# EAGLE design msxpi (EAGLE 7.7.0)
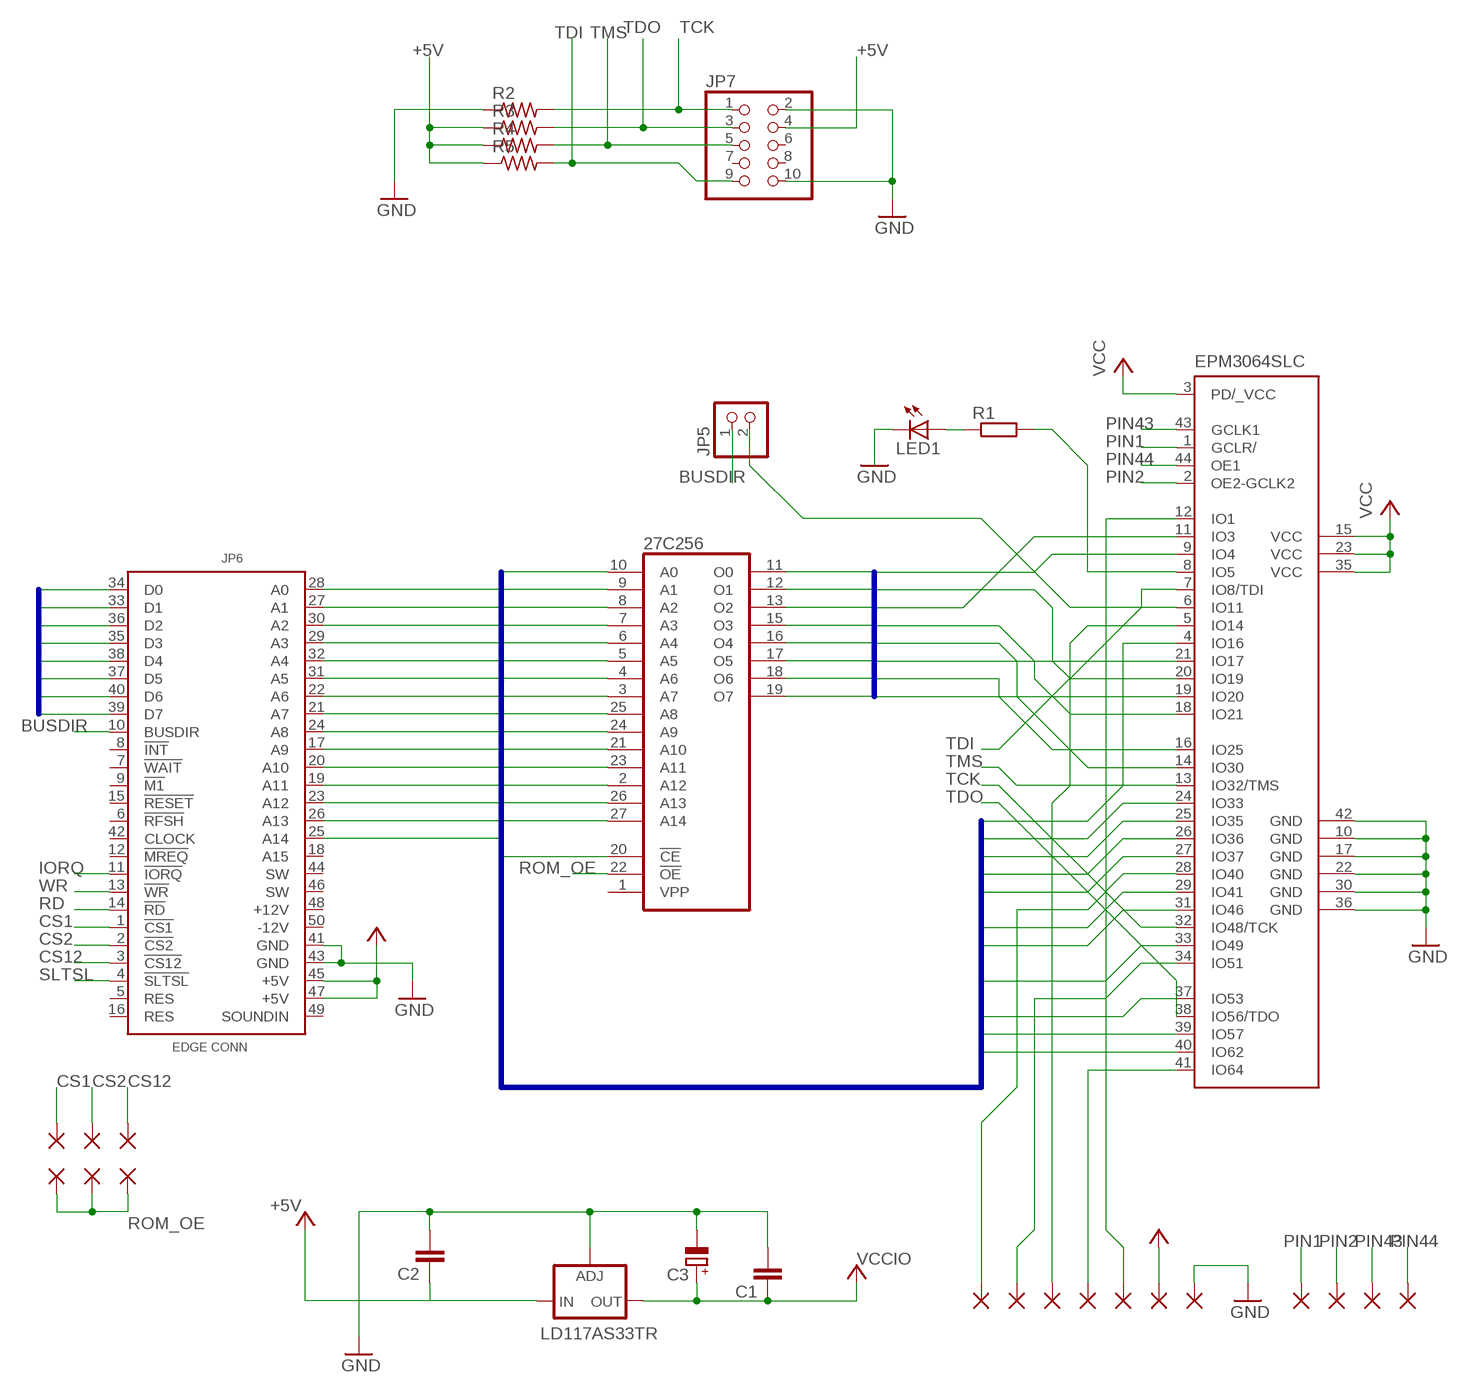
[diagram p0: schematic, sheet 1]

## Parts
27C256  27256  [DIL28]
+5V  2,15/1,0  [2,15/1,0]
C1  C2,5-3  [C2.5-3]
C2  C2,5-3  [C2.5-3]
C3  CPOL-EUE2.5-5  [E2,5-5]
CS1  2,15/1,0  [2,15/1,0]
CS2  2,15/1,0  [2,15/1,0]
CS12  2,15/1,0  [2,15/1,0]
EPM3064SLC  EPM3064S44  [PLCC-S44]
GND  2,15/1,0  [2,15/1,0]
GND4  2,15/1,0  [2,15/1,0]
GND9  2,15/1,0  [2,15/1,0]
GND10  2,15/1,0  [2,15/1,0]
GND11  2,15/1,0  [2,15/1,0]
IC1  LD117AS33TR  [SOT223]
JP5  PINHD-1X2  [1X02]
JP6  MSXCART1  [MSXCART]
JP7  PINHD-2X5/90  [2X05/90]
LED1  LED3MM  [LED3MM]
PAD1  2,15/1,0  [2,15/1,0]
PAD2  2,15/1,0  [2,15/1,0]
PAD8  2,15/1,0  [2,15/1,0]
PAD9  2,15/1,0  [2,15/1,0]
R1  R-EU_0207/7  [0207/7]
R2  R-US_0207/7  [0207/7]
R3  R-US_0207/7  [0207/7]
R4  R-US_0207/7  [0207/7]
R5  R-US_0207/7  [0207/7]
ROMOE1  2,15/1,0  [2,15/1,0]
ROMOE2  2,15/1,0  [2,15/1,0]
ROMOE3  2,15/1,0  [2,15/1,0]
SPI_CS_GPIO21  2,15/1,0  [2,15/1,0]

## Nets
+5V: +5V.1(P) C2.1 IC1.3(IN) JP6.45(+5V) JP6.47(+5V) JP7.4 R3.1 R4.1 R5.1 ; supply symbol labelled VCC
A0: 27C256.10(A0) EPM3064SLC.31(IO46) JP6.28(A0)
A1: 27C256.9(A1) EPM3064SLC.29(IO41) JP6.27(A1)
A2: 27C256.8(A2) EPM3064SLC.24(IO33) JP6.30(A2)
A3: 27C256.7(A3) EPM3064SLC.26(IO36) JP6.29(A3)
A4: 27C256.6(A4) EPM3064SLC.25(IO35) JP6.32(A4)
A5: 27C256.5(A5) EPM3064SLC.27(IO37) JP6.31(A5)
A6: 27C256.4(A6) EPM3064SLC.33(IO49) JP6.22(A6)
A7: 27C256.3(A7) EPM3064SLC.4(IO16) JP6.21(A7)
A8: 27C256.25(A8) JP6.24(A8)
A9: 27C256.24(A9) JP6.17(A9)
A10: 27C256.21(A10) JP6.20(A10)
A11: 27C256.23(A11) JP6.19(A11)
A12: 27C256.2(A12) JP6.23(A12)
A13: 27C256.26(A13) JP6.26(A13)
A14: 27C256.27(A14) JP6.25(A14)
BUSDIR: JP5.1 JP6.10(BUSDIR)
CS1: CS1.1(P) JP6.1(!CS1)
CS2: CS2.1(P) JP6.2(!CS2)
CS12: CS12.1(P) JP6.3(!CS12)
D0: 27C256.11(O0) EPM3064SLC.9(IO4) JP6.34(D0)
D1: 27C256.12(O1) EPM3064SLC.20(IO19) JP6.33(D1)
D2: 27C256.13(O2) EPM3064SLC.11(IO3) JP6.36(D2)
D3: 27C256.15(O3) EPM3064SLC.18(IO21) JP6.35(D3)
D4: 27C256.16(O4) EPM3064SLC.14(IO30) JP6.38(D4)
D5: 27C256.17(O5) EPM3064SLC.21(IO17) JP6.37(D5)
D6: 27C256.18(O6) EPM3064SLC.16(IO25) JP6.40(D6)
D7: 27C256.19(O7) EPM3064SLC.19(IO20) JP6.39(D7)
GND: C1.2 C2.2 C3.- EPM3064SLC.10(GND) EPM3064SLC.17(GND) EPM3064SLC.22(GND) EPM3064SLC.30(GND) EPM3064SLC.36(GND) EPM3064SLC.42(GND) GND.1(P) IC1.1(ADJ) JP6.41(GND) JP6.43(GND) JP7.2 JP7.10 LED1.K(C) R2.1
IORQ: EPM3064SLC.40(IO62) JP6.11(!IORQ)
MSXR1: EPM3064SLC.6(IO11) JP5.2
N$5: LED1.A R1.1
N$6: EPM3064SLC.8(IO5) R1.2
PI_RDY_GPIO25: EPM3064SLC.12(IO1) PAD2.1(P)
PIN1: EPM3064SLC.1(GCLR/) GND4.1(P)
PIN2: EPM3064SLC.2(OE2-GCLK2) GND9.1(P)
PIN43: EPM3064SLC.43(GCLK1) GND10.1(P)
PIN44: EPM3064SLC.44(OE1) GND11.1(P)
RD: EPM3064SLC.37(IO53) JP6.14(!RD)
ROM_OE: 27C256.22(!OE) ROMOE1.1(P) ROMOE2.1(P) ROMOE3.1(P)
SLTSL: 27C256.20(!CE) JP6.4(!SLTSL)
SPI_CS_GPIO21: EPM3064SLC.28(IO40) SPI_CS_GPIO21.1(P)
SPI_MISO_GPIO12: EPM3064SLC.41(IO64) PAD1.1(P)
SPI_MOSI_GPIO16: EPM3064SLC.5(IO14) PAD9.1(P)
SPI_SCLK_GPIO20: EPM3064SLC.34(IO51) PAD8.1(P)
TCK: EPM3064SLC.32(IO48/TCK) JP7.1 R2.2
TDI: EPM3064SLC.7(IO8/TDI) JP7.9 R5.2
TDO: EPM3064SLC.38(IO56/TDO) JP7.3 R3.2
TMS: EPM3064SLC.13(IO32/TMS) JP7.5 R4.2
VCCIO: C1.1 C3.+ EPM3064SLC.3(PD/_VCC) EPM3064SLC.15(VCC) EPM3064SLC.23(VCC) EPM3064SLC.35(VCC) IC1.4(OUT) ; supply symbol labelled VCC
WR: EPM3064SLC.39(IO57) JP6.13(!WR)
Unconnected: 27C256.1(VPP) JP6.5(RES) JP6.6(!RFSH) JP6.7(!WAIT) JP6.8(!INT) JP6.9(!M1) JP6.12(!MREQ) JP6.15(!RESET) JP6.16(RES) JP6.18(A15) JP6.42(CLOCK) JP6.44(SW) JP6.46(SW) JP6.48(+12V) JP6.49(SOUNDIN) JP6.50(-12V) JP7.6 JP7.7 JP7.8

## Buses
A[0..14],CS1,SLTSL,RD,WR,IORQ
D[0..7]

## Power pins joined to a net without a drawn wire
+5V: 27C256.28(VCC)
GND: 27C256.14(GND)

## Library data of the parts
27C256 = memory:27256: MEMORY
+5V CS1 CS2 CS12 GND GND4 GND9-GND11 PAD1 PAD2 PAD8 PAD9 ROMOE1-ROMOE3 SPI_CS_GPIO21 = wirepad:2,15/1,0: THROUGH-HOLE PAD
C1 C2 = capacitor-wima:C: CAPACITOR naming: grid - package width
C3 = rcl:CPOL-EU: POLARIZED CAPACITOR, European symbol
EPM3064SLC = EPM3064-PLCC:EPM3064: EPM3064 MAX 3000 family PLCC through hole socket; MPN: EPM3064SLC44-10N
IC1 = v-reg:LD117A?*: Low drop fixed and adjustable positive voltage regulators 1 A Source: http://www.st.com/stonline/products/literature/ds/7194/ld1117axx.pdf
JP5 = pinhead:PINHD-1X2: PIN HEADER
JP6 = msx-con-fbelavenuto:MSXCART
JP7 = pinhead:PINHD-2X5: PIN HEADER
LED1 = led:LED: LED OSRAM: - CHIPLED LG R971, LG N971, LY N971, LG Q971, LY Q971, LO R971, LY R971 LH N974, LH R974 LS Q976, LO Q976, LY Q976 LO Q996 - Hyper CHIPLED LW Q18S LB Q993, LB Q99A, LB R99A - SideLED LS A670, LO A670, LY A670, LG A670, LP A670 LB A673, LV A673, LT A673, LW A673 LH A674 LY A675 LS A676, LA A676, LO A676, LY A676, LW A676 LS A679, LY A679, LG A679 - Hyper Micro SIDELED® LS Y876, LA Y876, LO Y876, LY Y876 LT Y87S - SmartLED LW L88C, LW L88S LB L89C, LB L89S, LG L890 LS L89K, LO L89K, LY L89K LS L896, LA L896, LO L896, LY L896 - TOPLED LS T670, LO T670, LY T670, LG T670, LP T670 LSG T670, LSP T670, LSY T670, LOP T670, LYG T670 LG T671, LOG T671, LSG T671 LB T673, LV T673, LT T673, LW T673 LH T674 LS T676, LA T676, LO T676, LY T676, LB T676, LH T676, LSB T676, LW T676 LB T67C, LV T67C, LT T67C, LS T67K, LO T67K, LY T67K, LW E67C LS E67B, LA E67B, LO E67B, LY E67B, LB E67C, LV E67C, LT E67C LW T67C LS T679, LY T679, LG T679 LS T770, LO T770, LY T770, LG T770, LP T770 LB T773, LV T773, LT T773, LW T773 LH T774 LS E675, LA E675, LY E675, LS T675 LS T776, LA T776, LO T776, LY T776, LB T776 LHGB T686 LT T68C, LB T68C - Hyper Mini TOPLED® LB M676 - Mini TOPLED Santana® LG M470 LS M47K, LO M47K, LY M47K Source: http://www.osram.convergy.de LUXEON: - LUMILED® LXK2-PW12-R00, LXK2-PW12-S00, LXK2-PW14-U00, LXK2-PW14-V00 LXK2-PM12-R00, LXK2-PM12-S00, LXK2-PM14-U00 LXK2-PE12-Q00, LXK2-PE12-R00, LXK2-PE12-S00, LXK2-PE14-T00, LXK2-PE14-U00 LXK2-PB12-K00, LXK2-PB12-L00, LXK2-PB12-M00, LXK2-PB14-N00, LXK2-PB14-P00, LXK2-PB14-Q00 LXK2-PR12-L00, LXK2-PR12-M00, LXK2-PR14-Q00, LXK2-PR14-R00 LXK2-PD12-Q00, LXK2-PD12-R00, LXK2-PD12-S00 LXK2-PH12-R00, LXK2-PH12-S00 LXK2-PL12-P00, LXK2-PL12-Q00, LXK2-PL12-R00 Source: www.luxeon.com KINGBRIGHT: KA-3528ASYC Source: www.kingbright.com
R1 = rcl:R-EU_: RESISTOR, European symbol
R2-R5 = rcl:R-US_: RESISTOR, American symbol

## Board
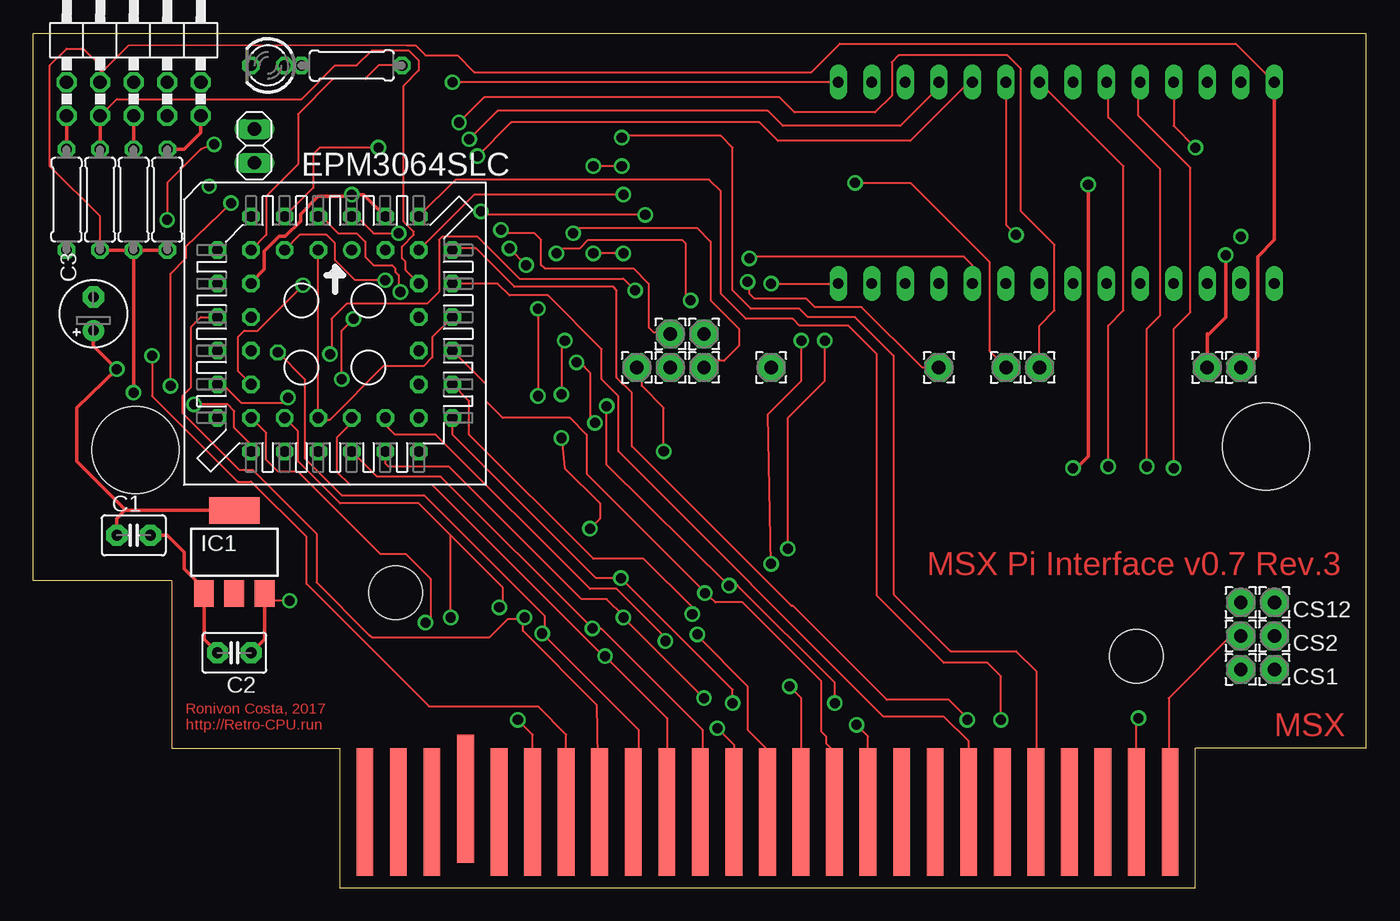
[diagram p1: board, top side]
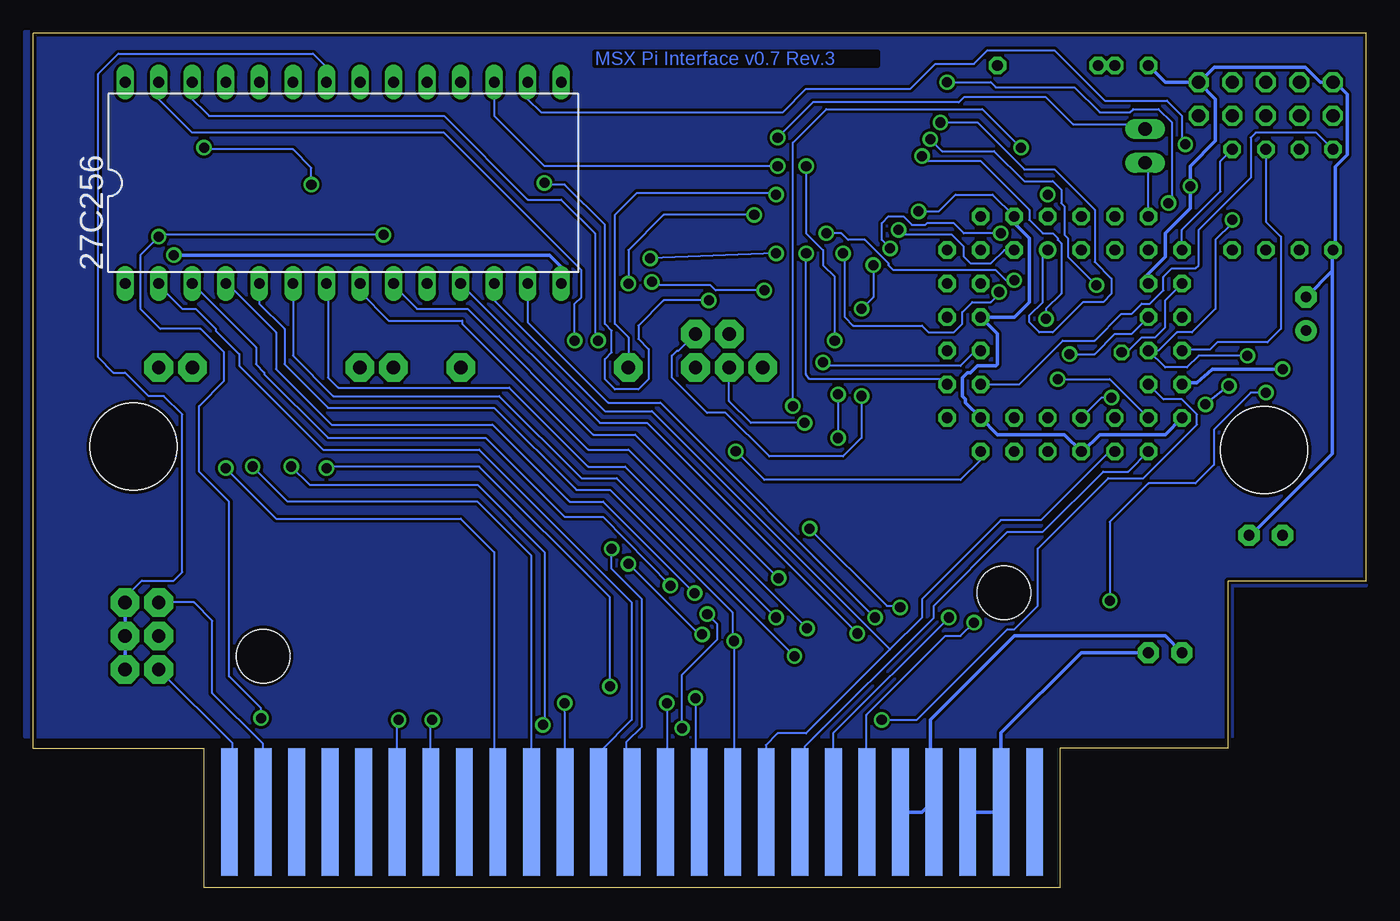
[diagram p2: board, bottom side, seen from below]

Size 100.96 x 64.68 mm. Coordinates in mm from the lower left corner, seen from the top.
Copper layers (1*16): Top 0.035mm / dielectric 1.5mm / Bottom 0.035mm
Design rules "default *": minimum track width 10mil, minimum drill 24mil, track to track 8mil, track to pad 8mil, pad to pad 8mil, via to via 8mil, smd to smd 8mil, copper to edge 10mil, drill to drill 8mil, minimum pad ring 10mil, minimum via ring 8mil, stop-mask expansion 4mil, vias tented up to drill 0mil, thermal gap 10mil

### Footprints (pad centres in the part's own frame; a part is rotated, then mirrored left to right if it is on the bottom)
DIL28 = drill 0.813 long: 1 -16.51,-7.62; 2 -13.97,-7.62; 3 -11.43,-7.62; 4 -8.89,-7.62; 5 -6.35,-7.62; 6 -3.81,-7.62; 7 -1.27,-7.62; 8 1.27,-7.62; 9 3.81,-7.62; 10 6.35,-7.62; 11 8.89,-7.62; 12 11.43,-7.62; 13 13.97,-7.62; 14 16.51,-7.62; 15 16.51,7.62; 16 13.97,7.62; 17 11.43,7.62; 18 8.89,7.62; 19 6.35,7.62; 20 3.81,7.62; 21 1.27,7.62; 22 -1.27,7.62; 23 -3.81,7.62; 24 -6.35,7.62; 25 -8.89,7.62; 26 -11.43,7.62; 27 -13.97,7.62; 28 -16.51,7.62
2,15/1,0 = drill 1.016 pad 2.159 octagon: 1 0,0
C2.5-3 = drill 0.813 pad 1.6 octagon: 1 -1.27,0; 2 1.27,0
E2,5-5 = drill 0.813 pad 1.6: + -1.27,0 | drill 0.813 pad 1.6 octagon: - 1.27,0
PLCC-S44 = drill 0.813: 1 1.27,6.35 | drill 0.813 octagon: 2 -1.27,8.89; 3 -1.27,6.35; 4 -3.81,8.89; 5 -3.81,6.35; 6 -6.35,8.89; 7 -8.89,6.35; 8 -6.35,6.35; 9 -8.89,3.81; 10 -6.35,3.81; 11 -8.89,1.27; 12 -6.35,1.27; 13 -8.89,-1.27; 14 -6.35,-1.27; 15 -8.89,-3.81; 16 -6.35,-3.81; 17 -8.89,-6.35; 18 -6.35,-8.89; 19 -6.35,-6.35; 20 -3.81,-8.89; 21 -3.81,-6.35; 22 -1.27,-8.89; 23 -1.27,-6.35; 24 1.27,-8.89; 25 1.27,-6.35; 26 3.81,-8.89; 27 3.81,-6.35; 28 6.35,-8.89; 29 8.89,-6.35; 30 6.35,-6.35; 31 8.89,-3.81; 32 6.35,-3.81; 33 8.89,-1.27; 34 6.35,-1.27; 35 8.89,1.27; 36 6.35,1.27; 37 8.89,3.81; 38 6.35,3.81; 39 8.89,6.35; 40 6.35,8.89; 41 6.35,6.35; 42 3.81,8.89; 43 3.81,6.35; 44 1.27,8.89
SOT223 = smd 1.5 x 2: 1 -2.3,-3.15; 2 0,-3.15; 3 2.3,-3.15 | smd 3.8 x 2: 4 0,3.15
1X02 = drill 1.016 long: 1 -1.27,0; 2 1.27,0
MSXCART = smd 1.27 x 9.652 bottom: 1 86.081,5.715; 3 83.541,5.715; 5 81.001,5.715; 7 78.461,5.715; 9 75.921,5.715; 11 73.381,5.715; 13 70.841,5.715; 15 68.301,5.715; 17 65.761,5.715; 19 63.221,5.715; 21 60.681,5.715; 23 58.141,5.715; 25 55.601,5.715; 27 53.061,5.715; 29 50.521,5.715; 31 47.981,5.715; 33 45.441,5.715; 35 42.901,5.715; 37 40.361,5.715; 39 37.821,5.715; 41 35.281,5.715; 43 32.741,5.715; 45 30.201,5.715; 47 27.661,5.715; 49 25.121,5.715 | smd 1.27 x 9.652: 2 86.081,5.715; 4 83.541,5.715; 6 81.001,5.715; 8 78.461,5.715; 10 75.921,5.715; 12 73.381,5.715; 14 70.841,5.715; 16 68.301,5.715; 18 65.761,5.715; 20 63.221,5.715; 22 60.681,5.715; 24 58.141,5.715; 26 55.601,5.715; 28 53.061,5.715; 30 50.521,5.715; 32 47.981,5.715; 34 45.441,5.715; 36 42.901,5.715; 38 40.361,5.715; 40 37.821,5.715; 42 35.281,5.715; 44 32.741,6.731; 46 30.201,5.715; 48 27.661,5.715; 50 25.121,5.715 | hole 4.064: 27.461,22.326; 83.53,17.526 | hole 6.604: 93.349,33.388; 7.742,33.118
2X05/90 = drill 1.016 octagon: 1 -5.08,-6.35; 2 -5.08,-3.81; 3 -2.54,-6.35; 4 -2.54,-3.81; 5 0,-6.35; 6 0,-3.81; 7 2.54,-6.35; 8 2.54,-3.81; 9 5.08,-6.35; 10 5.08,-3.81
LED3MM = drill 0.813 octagon: A -1.27,0; K 1.27,0
0207/7 = drill 0.813 octagon: 1 -3.81,0; 2 3.81,0

### Placement (x,y rotation side)
27C256  77.47,53.34 0 bottom
+5V  91.44,39.37 0 top
C1  7.62,26.67 0 top
C2  15.24,17.78 180 top
C3  4.57,43.43 90 top
CS1  91.44,16.51 0 top
CS2  91.44,19.05 0 top
CS12  91.44,21.59 0 top
EPM3064SLC  22.86,41.91 0 top
GND  88.9,39.37 0 top
GND4  76.2,39.37 0 top
GND9  73.66,39.37 0 top
GND10  48.26,41.91 0 top
GND11  50.8,41.91 0 top
IC1  15.24,25.4 0 top
JP5  16.76,56.13 270 top
JP6  0,0 0 top
JP7  7.62,64.77 0 top
LED1  17.78,62.23 180 top
PAD1  55.88,39.37 0 top
PAD2  68.58,39.37 0 top
PAD8  48.26,39.37 0 top
PAD9  50.8,39.37 0 top
R1  24.13,62.23 0 top
R2  2.54,52.07 90 top
R3  5.08,52.07 90 top
R4  7.62,52.07 90 top
R5  10.16,52.07 90 top
ROMOE1  93.98,21.59 0 top
ROMOE2  93.98,19.05 0 top
ROMOE3  93.98,16.51 0 top
SPI_CS_GPIO21  45.72,39.37 0 top

### Tracks (layer width: path | path; a pad name or v marks a point on that pad's centre or on a via)
+5V  (via drill 0.76 pad 0.76)
  Top 0.127: JP7.4 5.08,61.6 7.24,63.75 28.32,63.75
  Top 0.152: 27C256.28 92.58,62.36 91.95,62.99 91.06,63.88 61.09,63.88 58.93,61.72 33.4,61.72 32.13,62.99 29.72,62.99 28.96,63.75 28.32,63.75 | R3.1 5.08,50.8 1.27,54.61 1.27,62.23 2.54,63.5 3.81,63.5 5.08,62.23 JP7.4 | v19.43,21.72 18.07,21.72 IC1.3
  Top 0.254: 27C256.28 93.98,49.02 92.71,47.75 92.71,40.26 91.82,39.37 +5V.1 | R5.1 R4.1 | R4.1 R3.1 | IC1.3 17.54,18.81 C2.1 | v7.62,37.47 R4.1
  Bottom 0.152: v19.43,21.72 19.43,27.69 16.51,30.61 12.95,30.61 11.56,32 11.56,34.67 8.76,37.47 v7.62,37.47
  Bottom 0.254: C2.1 21.59,17.78 27.66,11.71 JP6.47 JP6.45
A0  (via drill 0.76 pad 0.76)
  Top 0.152: 27C256.10 71.12,47.12 70.48,47.75 54.36,47.75 v54.23,47.62 | v51.82,12.06 53.06,10.82 JP6.28 | EPM3064SLC.31 33.02,36.83 33.02,34.29 42.42,24.89 46.23,24.89 49.91,21.21 v49.91,20.7 | v44.7,48.01 v42.42,48.01
  Bottom 0.152: EPM3064SLC.31 32.13,38.48 42.16,38.48 42.42,38.86 v42.42,48.01 | v51.82,12.06 51.82,16.13 49.15,18.8 49.15,19.94 v49.91,20.7 | v44.7,48.01 v54.23,47.62
A1  (via drill 0.76 pad 0.76)
  Top 0.152: v52.96,13.97 52.96,14.99 v44.51,23.43 42.61,23.43 31.75,34.29 EPM3064SLC.29
  Bottom 0.152: 27C256.9 73.66,45.59 71.88,43.82 68.07,43.82 58.55,34.29 55.37,34.29 v44.51,23.43 | v52.96,13.97 52.96,5.82 JP6.27
A2  (via drill 0.76 pad 0.76)
  Top 0.152: JP6.30 50.67,5.87 50.67,11.94 42.99,19.62 v42.35,19.62 30.86,31.11 26.04,31.11 EPM3064SLC.24
  Bottom 0.152: 27C256.8 76.2,45.09 74.04,42.93 68.45,42.93 68.45,42.67 58.93,33.15 55.88,33.15 v42.35,19.62
A3  (via drill 0.76 pad 0.76)
  Top 0.152: EPM3064SLC.26 26.67,32.13 26.92,31.88 31.5,31.88 41.53,21.84 43.43,21.84 44.7,20.57 v44.7,20.45 v50.8,14.35
  Bottom 0.152: 50.42,5.82 JP6.29 50.8,5.99 v50.8,14.35 | 27C256.7 78.61,45.72 78.61,38.61 77.85,37.85 64.9,37.85 58.93,31.88 56.13,31.88 v44.7,20.45
A4  (via drill 0.76 pad 0.76)
  Top 0.152: EPM3064SLC.25 24.13,35.18 22.99,34.04 22.99,31.5 24,30.48 30.23,30.48 43.18,17.53 v43.31,17.53 48.01,12.83 48.01,5.74 JP6.32
  Bottom 0.152: 27C256.6 81.28,40.26 78.23,37.21 65.66,37.21 59.44,30.99 56.77,30.99 v43.31,17.53
A5  (via drill 0.76 pad 0.76)
  Top 0.152: EPM3064SLC.27 26.67,35.05 27.43,34.29 30.48,34.29 42.16,22.61 44.2,22.61 47.88,18.92 v47.88,18.67
  Bottom 0.152: JP6.31 47.88,5.82 v47.88,18.67 48.01,18.8 48.01,20.83 57.28,30.1 59.82,30.1 66.04,36.32 78.61,36.32 81.91,39.62 81.91,42.29 83.82,44.2 27C256.5
A6  (via drill 0.76 pad 0.76)
  Top 0.152: 51.25,21.99 v50.86,22.29 | EPM3064SLC.33 34.29,38.1 34.29,36.83 35.56,35.56 40.64,35.56 41.91,34.29 41.91,31.33 51.25,21.99 | 51.25,21.99 51.65,21.59 53.72,21.59 59.69,15.62 59.69,11.81 60.05,11.45 60.05,10.95 60.58,10.41 60.58,5.82 JP6.22
  Bottom 0.152: 27C256.4 86.23,45.72 82.55,42.04 82.55,39.24 78.36,35.05 66.17,35.05 60.33,29.21 57.78,29.21 v50.86,22.29
A7  (via drill 0.76 pad 0.76)
  Top 0.152: v60.71,13.97 60.71,15.49 53.34,22.86 v52.7,22.86 43.43,32 v43.43,36.45 | v26.16,56.01 21.72,56.01 21.21,55.5 21.21,52.96 EPM3064SLC.4
  Bottom 0.152: v43.43,36.45 43.43,56.39 40.89,58.93 29.08,58.93 v26.16,56.01 | JP6.21 60.68,12.68 v60.71,13.97 | 27C256.3 88.9,45.47 88.65,45.47 84.07,40.89 84.07,39.62 83.44,38.99 83.44,38.86 78.61,34.04 66.67,34.04 60.71,28.07 57.78,28.07 v52.7,22.86
A8  (via drill 0.76 pad 0.76)
  Top 0.152: JP6.24 58.14,14.38 v57.28,15.24 | 27C256.25 86.36,57.66 v88.01,56.01
  Top 0.254: v78.74,31.75 78.99,31.75 79.88,32.64 v79.88,53.21
  Bottom 0.152: v57.28,15.24 57.28,21.97 67.18,31.88 78.61,31.88 v78.74,31.75 | v79.88,53.21 79.88,54.48 81.28,55.88 87.88,55.88 v88.01,56.01
A9  (via drill 0.76 pad 0.76)
  Top 0.152: v86.36,31.75 86.36,42.29 87.63,43.56 87.63,54.48 83.69,58.42 83.69,60.83 27C256.24
  Bottom 0.152: v86.36,31.75 82.55,27.94 68.58,27.94 66.04,25.4 66.04,5.99 JP6.17
A10  (via drill 0.76 pad 0.76)
  Top 0.152: JP6.20 63.22,11.45 v62.36,12.32 | v81.41,31.88 81.41,42.55 82.55,43.69 82.55,54.61 27C256.21
  Bottom 0.152: v81.41,31.88 80.01,30.48 67.31,30.48 62.23,25.4 62.23,12.45 v62.36,12.32
A11  (via drill 0.76 pad 0.76)
  Top 0.152: v84.33,31.88 84.33,42.29 85.34,43.31 85.34,54.36 81.41,58.29 81.41,60.83 27C256.23
  Bottom 0.152: JP6.19 63.22,25.12 67.31,29.21 81.66,29.21 v84.33,31.88
A12
  Bottom 0.152: 27C256.2 91.44,45.59 89.66,43.82 88.65,43.82 87.12,42.29 87.12,42.16 85.34,40.39 85.34,39.5 78.99,33.15 67.18,33.15 55.63,21.59 55.63,12.7 57.91,10.41 57.91,9.27 58.55,8.64
  Bottom 0.254: 58.55,8.64 58.55,6.12 JP6.23
A13  (via drill 0.76 pad 0.76)
  Top 0.152: v55.88,24.51 55.63,35.81 58.17,38.35 v58.17,41.4 | v50.29,19.18 50.29,19.05 54.1,15.24 54.1,11.94 55.6,10.44
  Top 0.254: JP6.26 55.6,10.44
  Bottom 0.152: 27C256.26 89.15,60.71 89.15,59.94 87.63,58.42 69.85,58.42 63.5,52.07 60.96,52.07 58.42,49.53 58.42,41.66 v58.17,41.4 | 50.55,19.18 v55.88,24.51
  Bottom 0.254: v50.29,19.18 50.55,19.18
A14  (via drill 0.76 pad 0.76)
  Top 0.152: v57.15,25.65 57.15,35.56 59.94,38.35 v59.94,41.4
  Bottom 0.152: JP6.25 55.6,6.73 55.6,9.88 | 56.01,10.29 56.01,11.05 54.86,12.19 54.86,21.84 57.15,24.13 v57.15,25.65 | v59.94,41.4 59.94,44.2 59.44,44.7 59.44,46.74 69.85,57.15 88.9,57.15 91.44,59.69 27C256.27
  Bottom 0.254: 56.01,10.29 56.01,7.14 55.6,6.73
BUSDIR  (via drill 0.76 pad 0.76)
  Top 0.152: JP6.10 75.95,5.74 75.95,16.38 74.42,17.91 69.47,17.91 65.15,22.22 65.15,40.26 62.23,43.18 58.67,43.18 58.04,43.82 54.36,43.82 52.96,45.21 52.96,56.01 52.07,56.9 44.7,56.9 v44.58,56.77
  Bottom 0.152: v44.58,56.77 41.91,59.44 30.86,59.44 30.48,59.82 24.26,59.82 22.23,57.79 17.14,57.79 JP5.1
CS1
  Bottom 0.152: JP6.1 85.85,5.94 85.85,10.92 CS1.1
CS2
  Top 0.152: CS2.1 90.68,19.05 85.98,14.35 85.98,5.82 JP6.2
CS12
  Bottom 0.152: JP6.3 83.54,10.9 87.38,14.73 87.38,20.19 88.77,21.59 CS12.1
D0  (via drill 0.76, 0.76 pad 0.76)
  Top 0.152: v18.54,40.51 20.57,38.48 20.57,32.51 23.37,29.72 29.59,29.72 38.73,20.57 38.73,19.43 v38.54,19.24 45.85,11.94 45.85,6.12 JP6.34
  Bottom 0.152: v18.54,40.51 18.16,40.51 17.02,41.66 16,41.66 15.24,42.42 15.24,44.45 EPM3064SLC.9 | 27C256.11 58.04,35.18 54.48,35.18 v38.54,19.24
D1
  Bottom 0.152: 36.07,18.03 42.42,11.68 44.58,11.68 45.47,10.79 45.47,6.48 45.59,6.35 45.59,5.87 JP6.33 | 27C256.12 66.04,44.45 57.66,36.07 54.1,36.07 36.07,18.03 | EPM3064SLC.20 19.43,33.02 24.64,27.81 27.69,27.81 33.66,21.84 33.66,20.45 36.07,18.03
D2  (via drill 0.76 pad 0.76)
  Top 0.152: JP6.36 42.8,5.82 42.67,13.84 37.08,19.43 37.08,20.32 | EPM3064SLC.11 12.7,43.18 11.94,42.42 11.94,37.85 11.3,37.21 11.3,35.94 15.62,31.62 16.64,31.62 21.46,26.8 21.46,23.11 25.46,19.11 25.65,18.92 34.54,18.92 35.94,20.32 37.08,20.32 | 37.08,20.32 v37.21,20.45
  Bottom 0.152: 27C256.13 63.5,42.8 57.4,36.7 53.47,36.7 v37.21,20.45
D3  (via drill 0.76 pad 0.76)
  Top 0.152: 27C256.15 v31.75,60.96 | v14.99,51.82 11.56,48.51 11.56,47.62 10.41,46.48 v10.41,37.97 | EPM3064SLC.18 16.51,33.53 15.24,34.8 15.24,36.07 14.73,36.58 v12.19,36.58
  Bottom 0.152: 16.51,32.77 EPM3064SLC.18 18.03,31.5 19.94,31.5 24.51,26.92 27.18,26.92 32.77,21.34 32.77,20.45 42.54,10.67 42.54,6.07 JP6.35 | v31.75,60.96 28.45,60.96 28.07,60.58 22.1,60.58 20.19,58.67 17.91,58.67 17.65,58.93 15.75,58.93 14.73,57.91 14.73,52.07 v14.99,51.82 | v10.41,37.97 v12.19,36.58
D4  (via drill 0.76 pad 0.76)
  Top 0.152: JP6.38 40.36,11.58 38.23,13.72 29.97,13.72 20.7,22.99 20.7,26.54 16.51,30.73 15.49,30.73 9.02,37.21 v9.02,40.26 | v13.72,56.26 12.7,55.88 10.16,53.34 v10.16,50.55
  Bottom 0.152: 27C256.16 63.5,59.69 62.48,58.67 44.2,58.67 42.42,60.45 34.54,60.45 32.64,62.36 29.72,62.36 28.7,63.37 23.62,63.37 19.81,59.56 15.11,59.56 13.97,58.42 13.97,56.52 v13.72,56.26 | v10.16,50.55 10.16,50.29 11.43,49.02 11.43,43.82 13.21,42.04 14.35,42.04 15.75,40.64 EPM3064SLC.14 15.24,39.37 13.59,39.37 12.7,40.26 v9.02,40.26
D5  (via drill 0.76 pad 0.76)
  Top 0.152: v31.62,20.45 31.62,26.67 | 31.62,26.67 29.21,29.08 23.24,29.08 20.07,32.26 20.07,34.54 EPM3064SLC.21 | v44.58,54.61 v42.42,54.61 | 31.62,26.67 35.56,22.73 35.56,21.46 v35.31,21.21 | v40,34.04 40.26,31.75 42.93,29.08 42.93,27.94 v42.16,27.18 | v40.26,41.4 40.26,41.28 40,41.02 v40,37.34
  Bottom 0.152: JP6.37 40.36,11.71 v31.62,20.45 | 27C256.17 66.04,58.42 62.23,54.61 v44.58,54.61 | v42.42,54.61 42.42,49.53 41.15,48.26 41.15,47.12 40.26,46.23 v40.26,41.4 | v42.16,27.18 36.32,21.34 35.43,21.34 v35.31,21.21 | v40,37.34 v40,34.04
D6  (via drill 0.76 pad 0.76)
  Top 0.152: 27C256.18 68.58,60.58 65.66,57.66 56.77,57.66 55.63,58.8 35.18,58.8 v33.02,56.64 | EPM3064SLC.16 15.49,39.12 15.49,41.66 16,42.16 17.02,42.16 v20.45,45.59 | JP6.40 37.82,11.58 v36.7,12.7
  Bottom 0.152: v36.7,12.7 34.04,12.7 27.18,19.56 26.67,19.56 24.89,21.34 24.89,25.65 19.56,30.99 16.89,30.99 12.83,35.05 12.83,35.81 13.97,36.96 15.37,36.96 EPM3064SLC.16 | v33.02,56.64 32.13,55.75 28.19,55.75 25.91,53.47 23.75,53.47 23.11,52.83 23.11,51.82 22.86,51.56 22.86,49.4 22.61,49.15 22.61,47.75 v20.45,45.59
D7  (via drill 0.76 pad 0.76)
  Top 0.152: 27C256.19 70.87,60.96 66.42,56.52 56.39,56.52 54.99,57.91 36.2,57.91 v33.66,55.37 | v23.37,38.48 23.37,42.16 v24.26,43.05 | EPM3064SLC.19 17.65,34.42 17.65,32.39 18.54,31.5 20.07,31.5 26.29,25.27 28.19,25.27 30.1,23.37 30.1,20.45 v29.72,20.07
  Bottom 0.152: JP6.39 37.85,5.74 37.85,13.08 31.88,19.05 30.73,19.05 v29.72,20.07 | 24.26,43.43 v24.26,43.05 24.26,43.82 23.11,44.96 23.11,48.77 23.37,49.02 23.37,49.15 23.75,49.53 24.51,49.53 25.53,50.55 25.53,51.31 29.21,54.99 33.27,54.99 v33.66,55.37 | v23.37,38.48 19.43,38.48 EPM3064SLC.19
GND  (via drill 0.76, 0.76 pad 0.76)
  Top 0.152: v46.35,50.93 34.16,50.93 v33.91,51.18 | v55.88,45.72 27C256.14
  Top 0.254: C2.2 12.94,18.81 IC1.1 12.94,22.62 11.43,24.13 11.43,25.4 10.16,26.67 C1.2 | 88.9,41.78 90.3,43.18 v90.3,47.88 | 26.64,50.67 EPM3064SLC.42 25.02,52.45 v24.13,52.45 24,52.32 21.59,52.32 20.24,50.98 20.24,50.44 19.1,49.3 18.64,49.3 17.5,48.16 17.5,46.79 16.59,45.87 EPM3064SLC.10 | 88.9,41.78 88.9,41.91 | 88.9,41.78 GND.1
  Bottom 0.152: v33.91,51.18 32.38,51.18 31.11,52.45 28.32,52.45 EPM3064SLC.42 | v46.35,50.93 53.21,50.93 55.88,48.26 v55.88,45.72
  Bottom 0.254: C2.2 15.24,19.05 26.67,19.05 33.02,12.7 33.02,6.35 | 33.02,6.35 33.02,5.99 JP6.43 | JP6.41 33.66,5.72 33.02,6.35 | EPM3064SLC.42 26.67,50.29 25.53,49.15 25.53,44.32 26.67,43.18 EPM3064SLC.36 27.94,41.91 27.94,39.62 28.07,39.5 29.46,39.5 29.97,38.99 30.23,38.99 30.61,38.61 30.61,37.21 30.35,36.96 30.35,36.7 EPM3064SLC.30 27.94,34.29 22.86,34.29 EPM3064SLC.22 21.46,33.02 20.19,34.29 15.24,34.29 EPM3064SLC.17 | LED1.K 15.24,60.96 JP7.10 | EPM3064SLC.10 16.64,45.85 16.64,46.36 15.24,47.75 15.24,49.53 13.33,51.44 v13.33,53.09 13.33,54.61 11.43,56.52 11.43,59.69 JP7.10 | JP7.10 12.65,60.96 11.51,62.1 4.65,62.1 3.51,60.96 JP7.2 2.36,60.96 1.45,60.05 1.45,55.47 2.36,54.56 2.36,48.39 R2.1 2.59,48.16 2.59,46.69 | C1.2 8.76,26.67 2.59,32.84 2.59,46.69 | v90.3,47.88 61.85,47.88 60.96,46.99 27C256.14 | 2.59,46.69 C3.-
IORQ  (via drill 0.76 pad 0.76)
  Top 0.152: v73.28,12.7 73.28,16 72.26,17.02 68.96,17.02 63.88,22.1 63.88,40.39 61.72,42.55 58.04,42.55 57.53,43.05 53.97,43.05 52.07,44.96 52.07,52.71 51.18,53.59 32,53.59 EPM3064SLC.40
  Bottom 0.152: JP6.11 73.38,12.6 v73.28,12.7
MSXR1
  Bottom 0.152: EPM3064SLC.6 16.51,54.61 JP5.2
N$1
  pour Bottom: 0,64.77 101.6,64.77 101.6,11.43 10.16,11.43 10.16,22.86 0,22.86
N$5
  Top 0.254: LED1.A R1.1
N$6
  Top 0.152: R1.2 26.16,62.23 25.15,61.21 22.73,61.21 20.07,58.55 20.07,54.74 17.65,52.32 17.65,49.4 EPM3064SLC.8
PI_RDY_GPIO25  (via drill 0.76 pad 0.76)
  Top 0.152: PAD2.1 67.31,39.37 62.74,43.94 59.18,43.94 58.55,44.58 54.61,44.58 54.23,44.96 54.23,45.72 v54.1,45.85 | v22.48,40.39 22.61,40.51 22.61,43.05 23.75,44.2 29.85,44.2 30.73,45.09 30.73,49.02 30.99,49.28 33.66,49.28 36.83,46.1 44.7,46.1 v45.59,45.21
  Bottom 0.152: v22.48,40.39 20.57,40.39 19.05,41.91 17.78,41.91 EPM3064SLC.12 | v45.59,45.21 49.28,45.21 49.66,45.59 53.85,45.59 v54.1,45.85
PIN1  (via drill 0.76)
  Top 0.152: GND4.1 76.2,42.55 77.34,43.69 77.34,48.64 74.8,51.18 74.8,61.98 73.79,62.99 65.53,62.99 65.02,62.48 65.02,59.94 63.75,58.67 57.66,58.67 56.52,59.82 34.16,59.82 v32.26,57.91
  Bottom 0.152: EPM3064SLC.1 24.51,47.88 24.51,44.32 25.53,43.31 25.53,42.8 24.77,42.04 23.75,42.04 21.46,44.32 19.94,44.32 19.3,44.96 19.3,46.1 20.57,47.37 20.57,51.31 23.62,54.36 25.91,54.36 29.46,57.91 v32.26,57.91
PIN2  (via drill 0.76)
  Top 0.152: EPM3064SLC.2 21.84,50.8 23.11,49.53 24.51,49.53 25.15,48.9 25.15,47.75 25.78,47.12 27.18,47.12 27.43,46.86 27.43,46.61 27.69,46.36 27.69,45.21 v27.81,45.09 | v39.62,48.01 39.88,48.26 40,48.26 40.13,48.39 41.4,48.39 42.04,49.02 49.15,49.02 49.4,48.77 49.4,44.83 v49.78,44.45 | v62.23,53.34 66.42,53.34 72.39,47.37 72.39,40.64 GND9.1
  Bottom 0.152: v27.81,45.09 27.81,44.96 28.45,44.32 29.85,44.32 30.61,43.56 30.61,42.67 31.24,42.04 33.15,42.04 33.66,42.55 38.86,42.55 39.5,43.18 39.5,47.88 v39.62,48.01 | v49.78,44.45 53.21,44.45 55.12,42.55 55.12,41.53 54.36,40.77 54.36,38.48 55.12,37.72 56.9,37.72 57.66,38.48 57.66,40.01 57.15,40.51 57.15,42.16 57.66,42.67 57.66,50.16 60.71,53.21 62.1,53.21 v62.23,53.34
PIN43  (via drill 0.76)
  Top 0.152: GND10.1 48.13,42.04 46.99,42.04 46.61,42.42 46.61,45.72 45.47,46.86 38.73,46.86 38.48,47.12 38.48,49.02 37.97,49.53 35.69,49.53 v35.43,49.78
  Bottom 0.152: EPM3064SLC.43 27.43,48.26 28.45,47.24 29.97,47.24 30.48,47.75 30.48,48.51 31.37,49.4 35.05,49.4 v35.43,49.78
PIN44  (via drill 0.76)
  Top 0.152: EPM3064SLC.44 24.51,50.8 25.78,49.53 v27.69,49.53 | v36.07,48.39 v37.34,47.12 | v38.23,43.82 v38.23,37.21
  Bottom 0.152: v27.69,49.53 30.48,49.53 31.24,50.29 33.27,50.29 33.4,50.16 34.42,50.16 35.05,50.8 36.2,50.8 36.7,50.29 36.7,49.02 v36.07,48.39 | v37.34,47.12 37.34,44.7 v38.23,43.82 | v38.23,37.21 38.23,34.04 39.62,32.64 45.21,32.64 48.51,35.94 49.91,35.94 52.58,38.61 52.58,40.26 52.2,40.64 52.07,40.64 GND11.1
RD
  Top 0.152: JP6.14 70.84,11.07 68.96,12.95 64.39,12.95 44.32,33.02 44.32,37.21 43.05,38.48 43.05,40.77 38.99,44.83 36.07,44.83 35.18,45.72 EPM3064SLC.37
ROM_OE
  Bottom 0.152: ROMOE1.1 93.98,21.97 92.71,23.24 90.3,23.24 89.66,23.88 89.66,35.81 91.06,37.21 92.2,37.21 93.98,38.99 94.87,38.99 96.01,40.13 96.01,61.6 94.49,63.12 79.76,63.12 78.87,62.23 78.87,61.09 27C256.22
  Bottom 0.254: ROMOE3.1 ROMOE2.1 ROMOE1.1
SLTSL  (via drill 0.76 pad 0.76)
  Top 0.152: JP6.4 83.54,12.68 v83.69,12.83 | 27C256.20 73.66,50.16 v74.42,49.4
  Bottom 0.152: v74.42,49.4 91.31,49.4 v91.44,49.28 92.84,47.88 92.84,43.82 91.31,42.29 88.27,42.29 86.49,40.51 86.49,38.35 88.39,36.45 88.39,31.5 86.11,29.21 86.11,16 83.69,13.59 v83.69,12.83
SPI_CS_GPIO21  (via drill 0.76 pad 0.76)
  Top 0.152: v47.75,33.02 47.75,36.32 46.1,37.97 46.1,38.99
  Top 0.254: 46.1,38.99 SPI_CS_GPIO21.1
  Bottom 0.152: EPM3064SLC.28 29.21,32.39 30.73,30.86 45.59,30.86 v47.75,33.02
SPI_MISO_GPIO12  (via drill 0.76 pad 0.76)
  Top 0.152: v44.7,52.45 33.4,52.45 EPM3064SLC.41
  Bottom 0.152: v44.7,52.45 45.09,52.58 55.24,52.58 56.9,50.93 56.9,42.67 55.88,41.66 PAD1.1
SPI_MOSI_GPIO16  (via drill 0.76 pad 0.76)
  Top 0.152: v40.89,49.53 41.27,49.91 50.29,49.91 51.31,48.9 51.31,44.45 53.47,42.29 53.47,41.02 52.32,39.88 51.31,39.88 PAD9.1 | v26.67,45.97 24.38,45.97 22.86,47.5 22.86,48.77 22.23,49.4 20.19,49.4 EPM3064SLC.5
  Bottom 0.152: v26.67,45.97 27.3,45.97 28.07,46.74 35.81,46.74 36.2,47.12 36.2,47.24 37.97,49.02 39.24,49.02 39.75,49.53 v40.89,49.53
SPI_SCLK_GPIO20  (via drill 0.76 pad 0.76)
  Top 0.152: v41.15,39.75 41.4,39.75 42.16,38.99 42.16,35.56 v42.54,35.18
  Bottom 0.152: EPM3064SLC.34 29.59,40.64 30.73,39.5 40.89,39.5 v41.15,39.75 | v42.54,35.18 46.61,35.18 48.26,36.83 PAD8.1
TCK
  Top 0.254: JP7.1 R2.2
  Bottom 0.152: EPM3064SLC.32 26.29,38.1 22.99,41.4 20.57,41.4 18.54,43.43 17.78,43.43 17.02,44.2 16.38,44.2 15.37,45.21 15.37,46.23 14.73,46.86 12.95,46.86 12.7,47.12 12.7,49.78 8.76,53.72 8.76,56.77 8.38,57.15 3.81,57.15 R2.2
TDI
  Top 0.254: JP7.9 12.7,57.15 11.43,55.88 R5.2
  Bottom 0.152: EPM3064SLC.7 13.97,49.78 11.05,52.71 11.05,54.99 R5.2
TDO
  Top 0.152: JP7.3 6.35,59.69 20.32,59.69 22.86,62.23 24.51,62.23 25.65,63.37 28.45,63.37 29.21,62.61 29.21,61.85 28.07,60.71 28.07,50.42 28.83,49.66 28.83,49.4 27.94,48.51 27.94,47.62 28.19,47.37 28.19,46.74 EPM3064SLC.38
  Top 0.254: JP7.3 R3.2
TMS
  Top 0.254: R4.2 JP7.5
  Bottom 0.152: R4.2 7.62,50.42 6.48,49.28 6.48,42.29 7.49,41.28 11.3,41.28 11.81,40.77 13.84,40.77 EPM3064SLC.13
VCCIO  (via drill 0.76)
  Top 0.152: EPM3064SLC.3 EPM3064SLC.23 21.72,35.43 22.48,35.43 26.54,39.5 26.67,39.37 26.67,39.5 29.59,39.5 30.23,40.13 30.23,41.66 EPM3064SLC.35 | EPM3064SLC.15 14.35,38.1 15.75,36.7 18.92,36.7 v19.3,37.08
  Top 0.254: C1.1 6.35,27.94 6.96,28.55 IC1.4 7.01,28.55 3.3,32.26 3.3,36.32 v6.35,39.24 4.57,41.02 C3.+
  Bottom 0.152: v19.3,37.08 20.07,37.08 EPM3064SLC.23
  Bottom 0.254: v6.35,39.24 11.68,39.24 12.83,38.23 13.84,38.23 EPM3064SLC.15
WR  (via drill 0.76 pad 0.76)
  Top 0.152: v70.74,12.7 70.74,12.83 69.34,14.22 64.64,14.22 57.53,21.34 57.4,21.34 45.34,33.4 45.34,37.47 44.2,38.61 44.2,45.21 43.94,45.47 36.45,45.47 33.53,48.39 31.88,48.39 EPM3064SLC.39
  Bottom 0.152: JP6.13 70.84,12.6 v70.74,12.7

### Text on the board
Top: MSX Pi Interface v0.7 Rev.3 | Ronivon Costa, 2017 / http://Retro-CPU.run | MSX
Bottom: MSX Pi Interface v0.7 Rev.3